# Altium project WeatherMonitor.PrjPcb
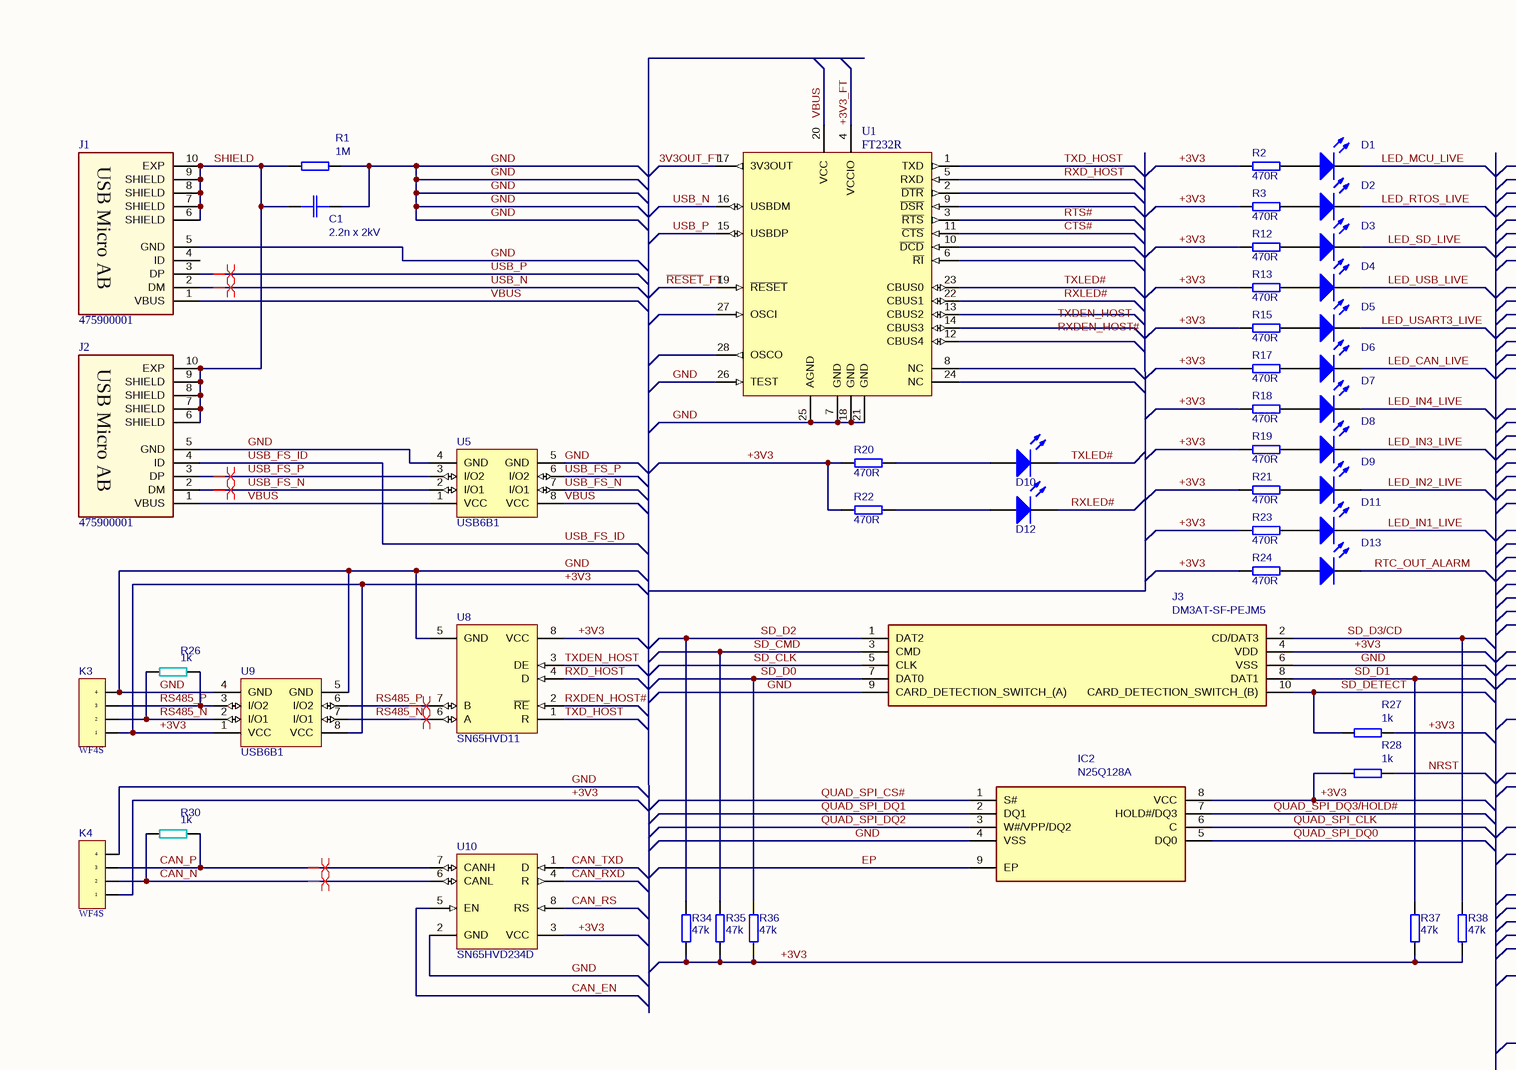
[diagram p0: WeatherMonitor.SchDoc, top left]
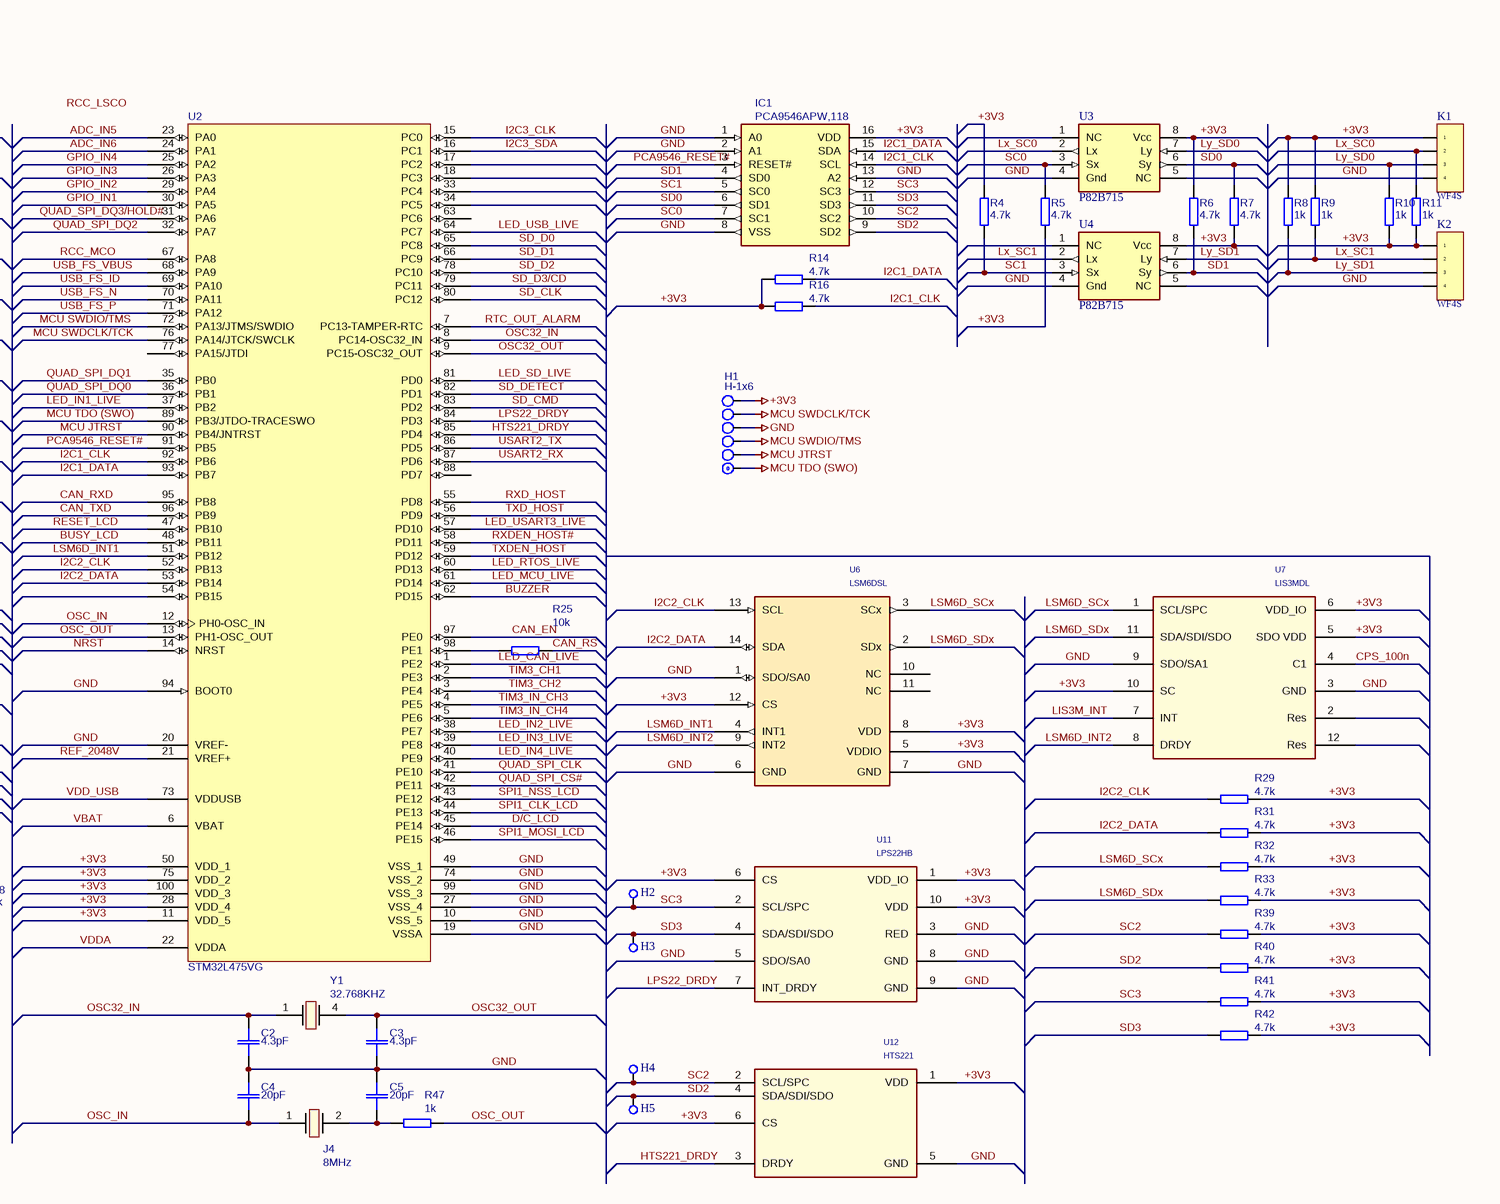
[diagram p1: WeatherMonitor.SchDoc, top right]
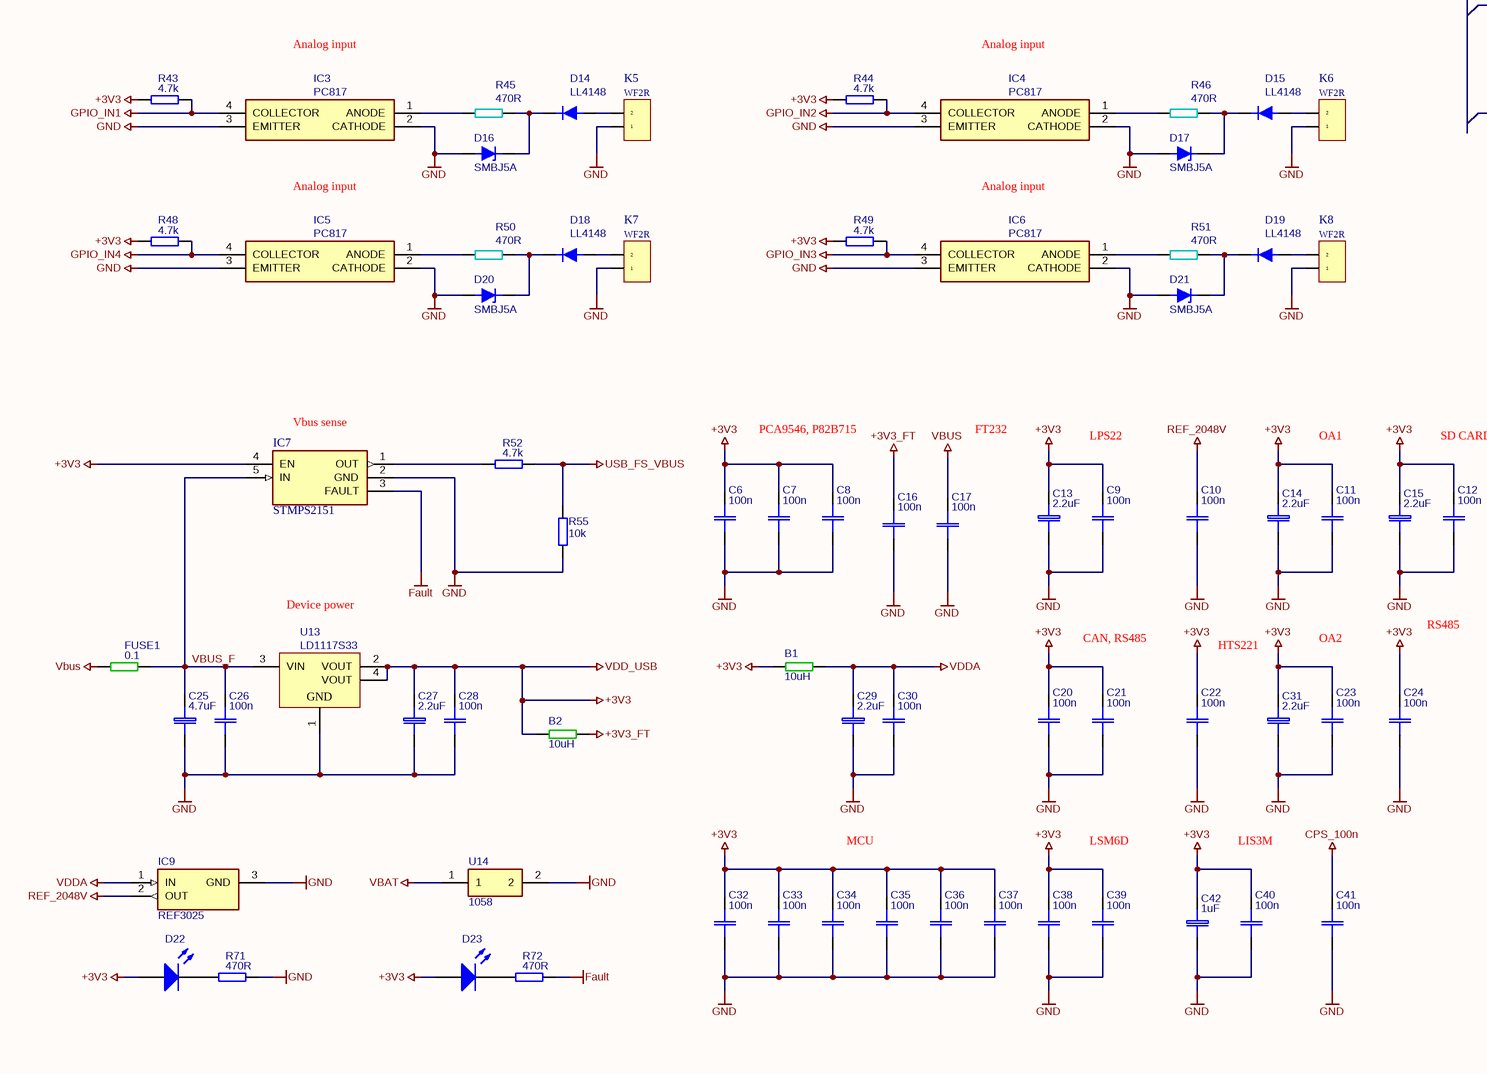
[diagram p2: WeatherMonitor.SchDoc, bottom left]
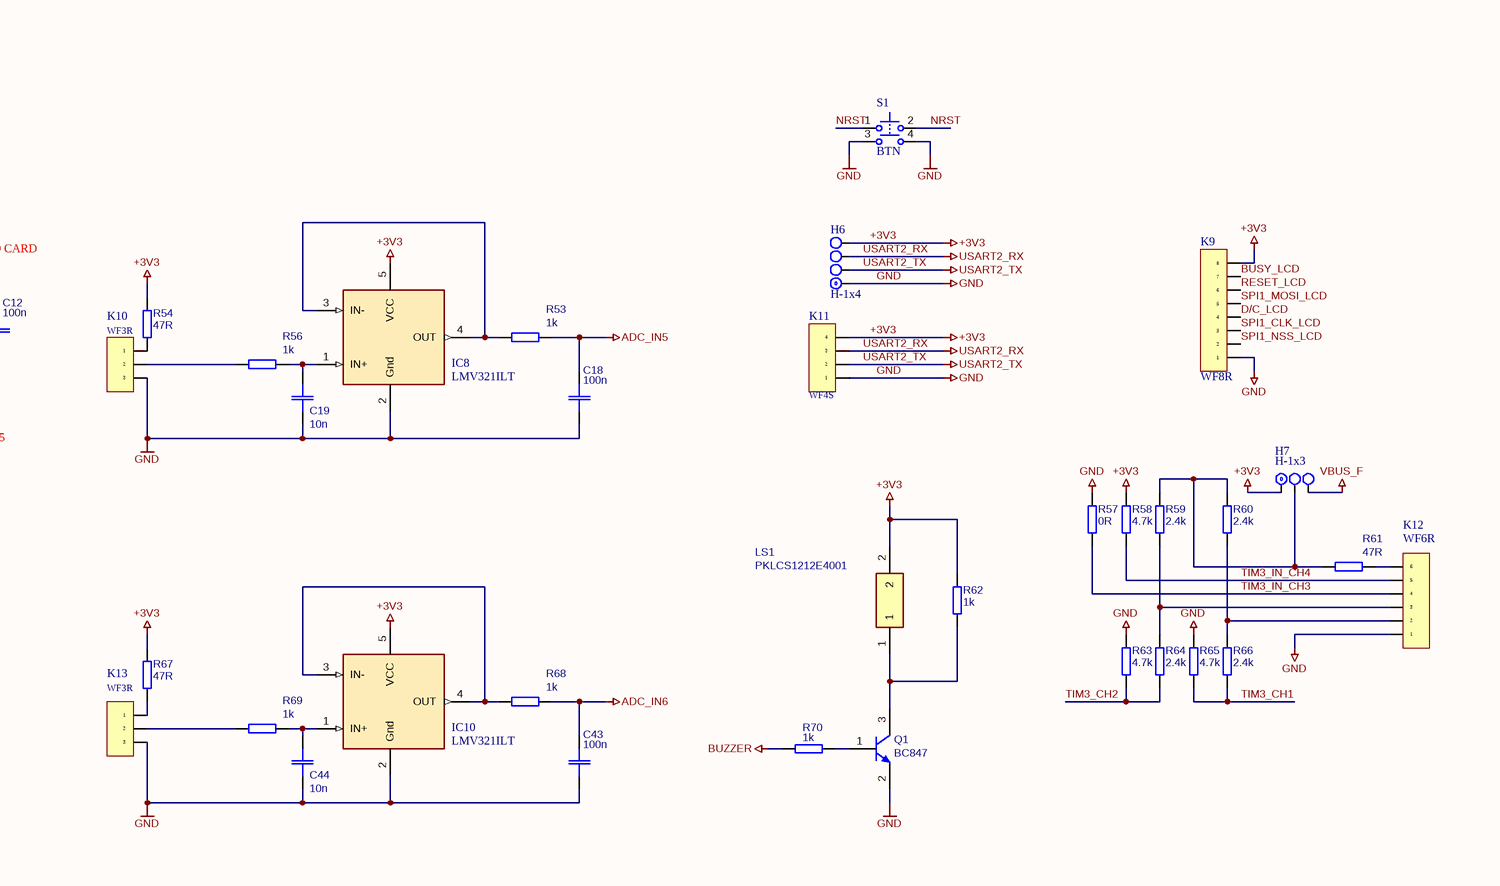
[diagram p3: WeatherMonitor.SchDoc, bottom right]
1 sheet, 194 parts. Net scope: global (net labels, ports and power ports of the same name join across sheets).
Board file: WeatherMonitor.PcbDoc

## Sheet WeatherMonitor.SchDoc
size A2

### Parts
B1  10uH  [R1210]
B2  10uH  [R1210]
C1  value 2.2n x 2kV  [C Y2 D13 7.5a]  (hidden comment: 2.2nF)
C2  4.3pF  [C0603]
C3  4.3pF  [C0603]
C4  20pF  [C0603]
C5  20pF  [C0603]
C6  100n  [C0805(2013)]
C7  100n  [C0805(2013)]
C8  100n  [C0805(2013)]
C9  100n  [C0805(2013)]
C10  value 100n  [C0805(2013)]  (hidden comment: 10n)
C11  100n  [C0805(2013)]
C12  100n  [C0805(2013)]
C13  2.2uF  [EL Case B (3528-21)]
C14  2.2uF  [EL Case B (3528-21)]
C15  2.2uF  [EL Case B (3528-21)]
C16  100n  [C0805(2013)]
C17  100n  [C0805(2013)]
C18  100n  [C0805(2013)]
C19  value 10n  [C0805(2013)]  (hidden comment: 100n)
C20  100n  [C0805(2013)]
C21  100n  [C0805(2013)]
C22  100n  [C0805(2013)]
C23  100n  [C0805(2013)]
C24  100n  [C0805(2013)]
C25  4.7uF  [EL Case B (3528-21)]
C26  100n  [C0805(2013)]
C27  2.2uF  [EL Case B (3528-21)]
C28  100n  [C0805(2013)]
C29  2.2uF  [EL Case B (3528-21)]
C30  100n  [C0805(2013)]
C31  2.2uF  [EL Case B (3528-21)]
C32  100n  [C0805(2013)]
C33  100n  [C0805(2013)]
C34  100n  [C0805(2013)]
C35  100n  [C0805(2013)]
C36  100n  [C0805(2013)]
C37  100n  [C0805(2013)]
C38  100n  [C0805(2013)]
C39  100n  [C0805(2013)]
C40  100n  [C0805(2013)]
C41  100n  [C0805(2013)]
C42  value 1uF  [EL Case B (3528-21)]  (hidden comment: 2.2uF)
C43  100n  [C0805(2013)]
C44  value 10n  [C0805(2013)]  (hidden comment: 100n)
D1  LED  [C0805(2013)]  (value not drawn)
D2  LED  [C0805(2013)]  (value not drawn)
D3  LED  [C0805(2013)]  (value not drawn)
D4  LED  [C0805(2013)]  (value not drawn)
D5  LED  [C0805(2013)]  (value not drawn)
D6  LED  [C0805(2013)]  (value not drawn)
D7  LED  [C0805(2013)]  (value not drawn)
D8  LED  [C0805(2013)]  (value not drawn)
D9  LED  [C0805(2013)]  (value not drawn)
D10  LED  [C0805(2013)]  (value not drawn)
D11  LED  [C0805(2013)]  (value not drawn)
D12  LED  [C0805(2013)]  (value not drawn)
D13  LED  [C0805(2013)]  (value not drawn)
D14  LL4148  [SOD80/MLL34]
D15  LL4148  [SOD80/MLL34]
D16  SMBJ5A  [DO-214AA (SMB)]
D17  SMBJ5A  [DO-214AA (SMB)]
D18  LL4148  [SOD80/MLL34]
D19  LL4148  [SOD80/MLL34]
D20  SMBJ5A  [DO-214AA (SMB)]
D21  SMBJ5A  [DO-214AA (SMB)]
D22  LED  [C0805(2013)]  (value not drawn)
D23  LED  [C0805(2013)]  (value not drawn)
FUSE1  0.1  [R1210]
H1  H-1x6  [J1x6]
H2  H-1  [J1]  (value not drawn)
H3  H-1  [J1]  (value not drawn)
H4  H-1  [J1]  (value not drawn)
H5  H-1  [J1]  (value not drawn)
H6  H-1x4  [J1x4]
H7  H-1x3  [J1x3]
IC1  PCA9546APW,118  [SOP65P640X110-16N]
IC2  N25Q128A  [SON127P800X600X100-9N-D]
IC3  PC817  [SOP254P960X420-4N]
IC4  PC817  [SOP254P960X420-4N]
IC5  PC817  [SOP254P960X420-4N]
IC6  PC817  [SOP254P960X420-4N]
IC7  STMPS2151  [SOT95P280X145-5N]
IC8  LMV321ILT  [SOT95P280X145-5N]
IC9  REF3025  [SOT95P237X112-3N]
IC10  LMV321ILT  [SOT95P280X145-5N]
J1  475900001  [CON_USBMICROAB_MOLEX_47590-0001_H3]
J2  475900001  [CON_USBMICROAB_MOLEX_47590-0001_H3]
J3  DM3AT-SF-PEJM5  [DM3AT-SF-PEJM5_1]
J4  8MHz  [LFXTAL003166Reel]
K1  WF4S  [WF4R]
K2  WF4S  [WF4R]
K3  WF4S  [WF4R]
K4  WF4S  [WF4R]
K5  WF2R  [WF2R]
K6  WF2R  [WF2R]
K7  WF2R  [WF2R]
K8  WF2R  [WF2R]
K9  WF8R  [WF8R]
K10  WF3R  [WF3R]
K11  WF4S  [WF4R]
K12  WF6R  [WF6R]
K13  WF3R  [WF3R]
LS1  PKLCS1212E4001  [PKLCS1212E4001]
Q1  BC847  [ONSC-SOT-23-3-318-08_V]
R1  1M  [R1206]
R2  470R  [R0805]
R3  470R  [R0805]
R4  4.7k  [R0805]
R5  4.7k  [R0805]
R6  4.7k  [R0805]
R7  4.7k  [R0805]
R8  1k  [R0805]
R9  1k  [R0805]
R10  1k  [R0805]
R11  1k  [R0805]
R12  470R  [R0805]
R13  470R  [R0805]
R14  4.7k  [R0805]
R15  470R  [R0805]
R16  4.7k  [R0805]
R17  470R  [R0805]
R18  470R  [R0805]
R19  470R  [R0805]
R20  470R  [R0805]
R21  470R  [R0805]
R22  470R  [R0805]
R23  470R  [R0805]
R24  470R  [R0805]
R25  10k  [R0805]
R26  value 1k  [R1206]  (hidden comment: 120R)
R27  1k  [R0805]
R28  value 1k  [R0805]  (hidden comment: 4.7k)
R29  4.7k  [R0805]
R30  value 1k  [R1206]  (hidden comment: 120R)
R31  4.7k  [R0805]
R32  4.7k  [R0805]
R33  4.7k  [R0805]
R34  47k  [R0805]
R35  47k  [R0805]
R36  47k  [R0805]
R37  47k  [R0805]
R38  47k  [R0805]
R39  4.7k  [R0805]
R40  4.7k  [R0805]
R41  4.7k  [R0805]
R42  4.7k  [R0805]
R43  4.7k  [R0805]
R44  4.7k  [R0805]
R45  470R  [R1206]
R46  470R  [R1206]
R47  value 1k  [R0805]  (hidden comment: 0R)
R48  4.7k  [R0805]
R49  4.7k  [R0805]
R50  470R  [R1206]
R51  470R  [R1206]
R52  4.7k  [R0805]
R53  1k  [R0805]
R54  47R  [R0805]
R55  10k  [R0805]
R56  1k  [R0805]
R57  0R  [R0805]
R58  4.7k  [R0805]
R59  2.4k  [R0805]
R60  2.4k  [R0805]
R61  47R  [R0805]
R62  1k  [R0805]
R63  4.7k  [R0805]
R64  2.4k  [R0805]
R65  4.7k  [R0805]
R66  2.4k  [R0805]
R67  47R  [R0805]
R68  1k  [R0805]
R69  1k  [R0805]
R70  1k  [R0805]
R71  470R  [R0805]
R72  470R  [R0805]
S1  BTN  [IT-2175]
U1  FT232R  [SSOP-28_N]
U2  STM32L475VG  [LQFP100_L]
U3  P82B715  [SOIC-8]
U4  P82B715  [SOIC-8]
U5  USB6B1  [SOIC-8]
U6  LSM6DSL  [LGA14L-2.5X3X0.86p0.5]
U7  LIS3MDL  [LGA12 2x2x1mm]
U8  SN65HVD11  [SOIC-8]
U9  USB6B1  [SOIC-8]
U10  SN65HVD234D  [SOIC-8]
U11  LPS22HB  [HLGA10L-2X2X0.76]
U12  HTS221  [HLGA6L-2x2x0.9]
U13  LD1117S33  [SOT-223_N]
U14  1058  [1058]
Y1  32.768KHZ  [ABS25]

### Nets
+3V3: B1.1 B2.1 C6.1 C7.1 C8.1 C9.1 C11.1 C12.1 C13.1(+) C14.1(+) C15.1(+) C20.1 C21.1 C22.1 C23.1 C24.1 C27.1(+) C28.1 C31.1(+) C32.1 C33.1 C34.1 C35.1 C36.1 C37.1 C38.1 C39.1 C40.1 C42.1(+) D22.1(A) D23.1(A) H1.6 H6.4 H7.1 IC1.16(VDD) IC2.8(VCC) IC7.4(EN) IC8.5(VCC) IC10.5(VCC) J3.4(VDD) K1.1 K2.1 K3.1 K4.1 K9.8 K11.4 LS1.2 R2.1 R3.1 R4.1 R5.2 R6.1 R7.2 R8.1 R9.1 R10.2 R11.2 R12.1 R13.1 R14.1 R15.1 R16.1 R17.1 R18.1 R19.1 R20.2 R21.1 R22.2 R23.1 R24.1 R27.1 R28.2 R29.2 R31.2 R32.2 R33.2 R34.2 R35.2 R36.2 R37.2 R38.2 R39.2 R40.2 R41.2 R42.2 R43.2 R44.2 R48.2 R49.2 R54.1 R58.1 R62.2 R67.1 U2.11(VDD_5) U2.28(VDD_4) U2.50(VDD_1) U2.73(VDDUSB) U2.75(VDD_2) U2.100(VDD_3) U3.8(Vcc) U4.8(Vcc) U6.5(VDDIO) U6.8(VDD) U6.12(CS) U7.5(SDO_VDD) U7.6(VDD_IO) U7.10(SC) U8.8(VCC) U9.1(VCC) U9.8(VCC) U10.3(VCC) U11.1(VDD_IO) U11.6(CS) U11.10(VDD) U12.1(VDD) U12.6(CS) U13.2(VOUT) U13.4(VOUT)  [also labelled VDD_USB]
+3V3_FT: B2.2 C16.1 U1.4(VCCIO)
ADC_IN5: C18.1 R53.1 U2.23(PA0)
ADC_IN6: C43.1 R68.1 U2.24(PA1)
BUZZER: R70.1 U2.62(PD15)
CPS_100n: C41.1 U7.4(C1)
Fault: IC7.3(FAULT) R72.1
GND: C1.2 C2.1 C3.1 C4.2 C5.2 C6.2 C7.2 C8.2 C9.2 C10.2 C11.2 C12.2 C13.2(-) C14.2(-) C15.2(-) C16.2 C17.2 C18.2 C19.2 C20.2 C21.2 C22.2 C23.2 C24.2 C25.2(-) C26.2 C27.2(-) C28.2 C29.2(-) C30.2 C31.2(-) C32.2 C33.2 C34.2 C35.2 C36.2 C37.2 C38.2 C39.2 C40.2 C41.2 C42.2(-) C43.2 C44.2 D16.1(A) D17.1(A) D20.1(A) D21.1(A) H1.4 H6.1 IC1.1(A0) IC1.2(A1) IC1.8(VSS) IC1.13(A2) IC2.4(VSS) IC3.2(CATHODE) IC3.3(EMITTER) IC4.2(CATHODE) IC4.3(EMITTER) IC5.2(CATHODE) IC5.3(EMITTER) IC6.2(CATHODE) IC6.3(EMITTER) IC7.2(GND) IC8.2(Gnd) IC9.3(GND) IC10.2(Gnd) J1.5(GND) J2.5(GND) J3.6(VSS) J3.9(CARD_DETECTION_SWITCH_(A)) K1.4 K2.4 K3.4 K4.4 K5.1 K6.1 K7.1 K8.1 K9.1 K10.3 K11.1 K12.1 K13.3 Q1.2(E) R1.1 R55.2 R57.1 R63.1 R65.1 R71.1 S1.3 S1.4 U1.7(GND) U1.18(GND) U1.21(GND) U1.25(AGND) U1.26(TEST) U2.10(VSS_5) U2.19(VSSA) U2.20(VREF-) U2.27(VSS_4) U2.49(VSS_1) U2.74(VSS_2) U2.94(BOOT0) U2.99(VSS_3) U3.4(Gnd) U4.4(Gnd) U5.4(GND) U5.5(GND) U6.1(SDO/SA0) U6.6(GND) U6.7(GND) U7.3(GND) U7.9(SDO/SA1) U8.5(GND) U9.4(GND) U9.5(GND) U10.2(GND) U11.3(RED) U11.5(SDO/SA0) U11.8(GND) U11.9(GND) U12.5(GND) U13.1(GND) U14.2
GPIO_IN1: IC3.4(COLLECTOR) R43.1 U2.30(PA5)
GPIO_IN2: IC4.4(COLLECTOR) R44.1 U2.29(PA4)
GPIO_IN3: IC6.4(COLLECTOR) R49.1 U2.26(PA3)
GPIO_IN4: IC5.4(COLLECTOR) R48.1 U2.25(PA2)
MCU JTRST: H1.2 U2.90(PB4/JNTRST)
MCU SWDCLK/TCK: H1.5 U2.76(PA14/JTCK/SWCLK)
MCU SWDIO/TMS: H1.3 U2.72(PA13/JTMS/SWDIO)
MCU TDO (SWO): H1.1 U2.89(PB3/JTDO-TRACESWO)
REF_2048V: C10.1 IC9.2(OUT) U2.21(VREF+)
USART2_RX: H6.3 K11.3 U2.87(PD6)
USART2_TX: H6.2 K11.2 U2.86(PD5)
USB_FS_VBUS: R52.1 R55.1 U2.68(PA9)
VBAT: U2.6(VBAT) U14.1
VBUS: C17.1 FUSE1.2 J1.1(VBUS) J2.1(VBUS) U1.20(VCC) U5.1(VCC) U5.8(VCC)
VBUS_F: C25.1(+) C26.1 FUSE1.1 H7.3 IC7.5(IN) U13.3(VIN)
VDDA: B1.2 C29.1(+) C30.1 IC9.1(IN) U2.22(VDDA)
3V3OUT_FT: U1.17(3V3OUT)
BUSY_LCD: K9.7 U2.48(PB11)
CAN_EN: U2.97(PE0) U10.5(EN)
CAN_N: K4.2 R30.2 U10.6(CANL)
CAN_P: K4.3 R30.1 U10.7(CANH)
CAN_RS: R25.2 U10.8(RS)
CAN_RXD: U2.95(PB8) U10.4(R)
CAN_TXD: U2.96(PB9) U10.1(D)
CTS#: U1.11(~{CTS})
D/C_LCD: K9.4 U2.45(PE14)
EP: IC2.9(EP)
HTS221_DRDY: U2.85(PD4) U12.3(DRDY)
I2C1_CLK: IC1.14(SCL) R16.2 U2.92(PB6)
I2C1_DATA: IC1.15(SDA) R14.2 U2.93(PB7)
I2C2_CLK: R29.1 U2.52(PB13) U6.13(SCL)
I2C2_DATA: R31.1 U2.53(PB14) U6.14(SDA)
I2C3_CLK: U2.15(PC0)
I2C3_SDA: U2.16(PC1)
LED_CAN_LIVE: D6.2(K) U2.1(PE2)
LED_IN1_LIVE: D11.2(K) U2.37(PB2)
LED_IN2_LIVE: D9.2(K) U2.38(PE7)
LED_IN3_LIVE: D8.2(K) U2.39(PE8)
LED_IN4_LIVE: D7.2(K) U2.40(PE9)
LED_MCU_LIVE: D1.2(K) U2.61(PD14)
LED_RTOS_LIVE: D2.2(K) U2.60(PD13)
LED_SD_LIVE: D3.2(K) U2.81(PD0)
LED_USART3_LIVE: D5.2(K) U2.57(PD10)
LED_USB_LIVE: D4.2(K) U2.64(PC7)
LIS3M_INT: U7.7(INT)
LPS22_DRDY: U2.84(PD3) U11.7(INT_DRDY)
LSM6D_INT1: U2.51(PB12) U6.4(INT1)
LSM6D_INT2: U6.9(INT2) U7.8(DRDY)
LSM6D_SCx: R32.1 U6.3(SCx) U7.1(SCL/SPC)
LSM6D_SDx: R33.1 U6.2(SDx) U7.11(SDA/SDI/SDO)
Lx_SC0: K1.2 R11.1 U3.2(Lx)
Lx_SC1: K2.2 R9.2 U4.2(Lx)
Ly_SD0: K1.3 R10.1 U3.7(Ly)
Ly_SD1: K2.3 R8.2 U4.7(Ly)
NRST: R28.1 S1.1 S1.2 U2.14(NRST)
OSC32_IN: C2.2 U2.8(PC14-OSC32_IN) Y1.1
OSC32_OUT: C3.2 U2.9(PC15-OSC32_OUT) Y1.4
OSC_IN: C4.1 J4.1 U2.12(PH0-OSC_IN)
OSC_OUT: R47.1 U2.13(PH1-OSC_OUT)
PCA9546_RESET#: IC1.3(RESET#) U2.91(PB5)
QUAD_SPI_CLK: IC2.6(C) U2.41(PE10)
QUAD_SPI_CS#: IC2.1(S#) U2.42(PE11)
QUAD_SPI_DQ0: IC2.5(DQ0) U2.36(PB1)
QUAD_SPI_DQ1: IC2.2(DQ1) U2.35(PB0)
QUAD_SPI_DQ2: IC2.3(W#/VPP/DQ2) U2.32(PA7)
QUAD_SPI_DQ3/HOLD#: IC2.7(HOLD#/DQ3) U2.31(PA6)
~{RESET}_FT: U1.19(~{RESET})
RCC_MCO: U2.67(PA8)
RESET_LCD: K9.6 U2.47(PB10)
RS485_N: K3.2 R26.2 U8.6(A) U9.2(I/O1) U9.7(I/O1)
RS485_P: K3.3 R26.1 U8.7(B) U9.3(I/O2) U9.6(I/O2)
RTC_OUT_ALARM: D13.2(K) U2.7(PC13-TAMPER-RTC)
RTS#: U1.3(~{RTS})
RXD_HOST: U1.5(RXD) U2.55(PD8) U8.4(D)
RXDEN_HOST#: U2.58(PD11) U8.2(~{RE})
RXLED#: D12.2(K) U1.22(CBUS1)
SC0: IC1.7(SC1) R5.1 U3.3(Sx)
SC1: IC1.5(SC0) R4.2 U4.3(Sx)
SC2: H4.1 IC1.10(SC2) R39.1 U12.2(SCL/SPC)
SC3: H2.1 IC1.12(SC3) R41.1 U11.2(SCL/SPC)
SD0: IC1.6(SD1) R7.1 U3.6(Sy)
SD1: IC1.4(SD0) R6.2 U4.6(Sy)
SD2: H5.1 IC1.9(SD2) R40.1 U12.4(SDA/SDI/SDO)
SD3: H3.1 IC1.11(SD3) R42.1 U11.4(SDA/SDI/SDO)
SD_CLK: J3.5(CLK) U2.80(PC12)
SD_CMD: J3.3(CMD) R35.1 U2.83(PD2)
SD_D0: J3.7(DAT0) R36.1 U2.65(PC8)
SD_D1: J3.8(DAT1) R37.1 U2.66(PC9)
SD_D2: J3.1(DAT2) R34.1 U2.78(PC10)
SD_D3/CD: J3.2(CD/DAT3) R38.1 U2.79(PC11)
SD_DETECT: J3.10(CARD_DETECTION_SWITCH_(B)) R27.2 U2.82(PD1)
SHIELD: C1.1 J1.6(SHIELD) J1.7(SHIELD) J1.8(SHIELD) J1.9(SHIELD) J1.10(EXP) J2.6(SHIELD) J2.7(SHIELD) J2.8(SHIELD) J2.9(SHIELD) J2.10(EXP) R1.2
SPI1_CLK_LCD: K9.3 U2.44(PE13)
SPI1_MOSI_LCD: K9.5 U2.46(PE15)
SPI1_NSS_LCD: K9.2 U2.43(PE12)
TIM3_CH1: R65.2 R66.2 U2.2(PE3)
TIM3_CH2: R63.2 R64.2 U2.3(PE4)
TIM3_IN_CH3: K12.4 R57.2 U2.4(PE5)
TIM3_IN_CH4: K12.5 R58.2 U2.5(PE6)
TXD_HOST: U1.1(TXD) U2.56(PD9) U8.1(R)
TXDEN_HOST: U2.59(PD12) U8.3(DE)
TXLED#: D10.2(K) U1.23(CBUS0)
USB_FS_ID: J2.4(ID) U2.69(PA10)
USB_FS_N: J2.2(DM) U2.70(PA11) U5.2(I/O1) U5.7(I/O1)
USB_FS_P: J2.3(DP) U2.71(PA12) U5.3(I/O2) U5.6(I/O2)
USB_N: J1.2(DM) U1.16(USBDM)
USB_P: J1.3(DP) U1.15(USBDP)
NetC5_1: C5.1 J4.2 R47.2
NetC19_1: C19.1 IC8.1(IN+) R56.1
NetC44_1: C44.1 IC10.1(IN+) R69.1
NetD1_1: D1.1(A) R2.2
NetD2_1: D2.1(A) R3.2
NetD3_1: D3.1(A) R12.2
NetD4_1: D4.1(A) R13.2
NetD5_1: D5.1(A) R15.2
NetD6_1: D6.1(A) R17.2
NetD7_1: D7.1(A) R18.2
NetD8_1: D8.1(A) R19.2
NetD9_1: D9.1(A) R21.2
NetD10_1: D10.1(A) R20.1
NetD11_1: D11.1(A) R23.2
NetD12_1: D12.1(A) R22.1
NetD13_1: D13.1(A) R24.2
NetD14_1: D14.1(A) K5.2
NetD14_2: D14.2(C) D16.2(C) R45.1
NetD15_1: D15.1(A) K6.2
NetD15_2: D15.2(C) D17.2(C) R46.1
NetD18_1: D18.1(A) K7.2
NetD18_2: D18.2(C) D20.2(C) R50.1
NetD19_1: D19.1(A) K8.2
NetD19_2: D19.2(C) D21.2(C) R51.1
NetD22_2: D22.2(K) R71.2
NetD23_2: D23.2(K) R72.2
NetH7_2: H7.2 R59.1 R60.1 R61.2
NetIC3_1: IC3.1(ANODE) R45.2
NetIC4_1: IC4.1(ANODE) R46.2
NetIC5_1: IC5.1(ANODE) R50.2
NetIC6_1: IC6.1(ANODE) R51.2
NetIC7_1: IC7.1(OUT) R52.2
NetIC8_3: IC8.3(IN-) IC8.4(OUT) R53.2
NetIC10_3: IC10.3(IN-) IC10.4(OUT) R68.2
NetK10_1: K10.1 R54.2
NetK10_2: K10.2 R56.2
NetK12_2: K12.2 R60.2 R66.1
NetK12_3: K12.3 R59.2 R64.1
NetK12_6: K12.6 R61.1
NetK13_1: K13.1 R67.2
NetK13_2: K13.2 R69.2
NetLS1_1: LS1.1 Q1.3(C) R62.1
NetQ1_1: Q1.1(B) R70.2
NetR25_1: R25.1 U2.98(PE1)

Not connected (* = marked no-connect by the designer): J1 4(ID); U1 2(~{DTR}) 6(~{RI}) 8(NC) 9(~{DSR}) 10(~{DCD}) 12(CBUS4) 13(CBUS2) 14(CBUS3) 24(NC) 27(OSCI) 28(OSCO); U2 17(PC2) 18(PC3) 33(PC4) 34(PC5) 54(PB15) 63(PC6) 77(PA15/JTDI) 88(PD7); U3 1(NC) 5(NC); U4 1(NC) 5(NC); U6 10(NC) 11(NC); U7 2(Res) 12(Res)

### Layout directives
differential pair: CAN_N, CAN_P, RS485_N, RS485_P, USB_FS_N, USB_FS_P, USB_N
differential pair; net class USBUART: USB_P

### Notes on the sheet
- Analog input
- (near IC7) Vbus sense
- PCA9546, P82B715
- FT232
- LPS22
- OA1
- SD CARD
- Device power
- CAN, RS485
- HTS221
- OA2
- RS485
- MCU
- LSM6D
- LIS3M
- Labels drawn without touching a wire or pin: RCC_LSCO, RXDEN_HOST#, TXDEN_HOST
- (in symbol 475900001) USB Micro AB

### Library data of the parts
B1 B2 FUSE1 = R-1210: SMD 1210 0.25W 5% 200V; Price: 0.045
  B1 B2: Value: 10uH
  FUSE1: Value: 0.1
C1 C6-C12 C16-C24 C26 C28 C30 C32-C41 C43 C44 = C-0805: SMD-0805; Price: 0.014
  C6-C9 C11 C12 C16-C18 C20-C24 C26 C28 C30 C32-C41 C43: Value: 100n
C2-C5 = C-0603: SMD-0603; Price: 0.014
  C2 C3: Value: 4.3pF
  C4 C5: Value: 20pF
C13-C15 C25 C27 C29 C31 C42 = EL Case D (7343-31): EL Tantalum Case D (7343-31); Price: 0.60
  C13-C15 C27 C29 C31: Value: 2.2uF
  C25: Value: 4.7uF
D1-D13 D22 D23 = HSMZ-C190: High Performance Chip LED, Red; LuminousIntensity: 40mcd (Minimum).; PCB_Layout: Complies with manufacturer's recommendation.; Published: 11-Dec-2002; DatasheetVersion: 11-Mar-2002; PackageVersion: Mar-2002; PackageReference: 1.6X0.8X0.8; Publisher: Altium Limited; PackageDescription: SM LED; 2 Flat Leads; LED_Colour: Red; ComponentLink1Description: Manufacturer Link; ComponentLink1URL: http://www.avagotech.com/; ComponentLink2Description: Datasheet; ComponentLink2URL: http://cp.literature.agilent.com/litweb/pdf/5988-5891EN.pdf
D14 D15 D18 D19 = LL4148: 75V 0.3A SOD80/MLL34; Price: 0.006
D16 D17 D20 D21 = SMBJ18A: TVS SMB 600W 18V; Price: 0.29
IC1 = PCA9546APW,118: Integrated Circuit; Manufacturer_Name: Nexperia; Datasheet Link: https://componentsearchengine.com/Datasheets/1/PCA9546APW,118.pdf; Mouser Part Number: 771-PCA9546APW-T; Mouser Price/Stock: https://www.mouser.com/Search/Refine.aspx?Keyword=771-PCA9546APW-T; Manufacturer_Part_Number: PCA9546APW,118
IC2 = N25Q128A13EF840E: Integrated Circuit; Manufacturer_Name: Micron; Datasheet Link: https://componentsearchengine.com/Datasheets/1/N25Q128A13EF840E.pdf; Height: 1mm; Mouser Part Number: 340-182262; Mouser Price/Stock: https://www.mouser.com/Search/Refine.aspx?Keyword=340-182262; Manufacturer_Part_Number: N25Q128A13EF840E
IC3-IC6 = PC817X1NIP1B: Integrated Circuit; Manufacturer_Name: Sharp Microelectronics; Datasheet Link: https://componentsearchengine.com/Datasheets/1/PC817X1NIP1B.pdf; Height: 4.2mm; Mouser Part Number: 852-PC817X1NIP1B; Mouser Price/Stock: https://www.mouser.com/Search/Refine.aspx?Keyword=852-PC817X1NIP1B; Manufacturer_Part_Number: PC817X1NIP1B
IC7 = STMPS2151STR: Integrated Circuit; Manufacturer_Name: STMicroelectronics; Datasheet Link: https://componentsearchengine.com/Datasheets/1/STMPS2151STR.pdf; Height: 1.45mm; Mouser Part Number: 511-STMPS2151STR; Mouser Price/Stock: https://www.mouser.com/Search/Refine.aspx?Keyword=511-STMPS2151STR; Manufacturer_Part_Number: STMPS2151STR
IC8 IC10 = LMV321ILT: Integrated Circuit; Manufacturer_Name: STMicroelectronics; Datasheet Link: https://componentsearchengine.com/Datasheets/1/LMV321ILT.pdf; Height: 1.45mm; Mouser Part Number: 511-LMV321ILT; Mouser Price/Stock: https://www.mouser.com/Search/Refine.aspx?Keyword=511-LMV321ILT; Manufacturer_Part_Number: LMV321ILT
IC9 = REF3020AIDBZT: Integrated Circuit; Manufacturer_Name: Texas Instruments; Datasheet Link: http://www.ti.com/lit/ds/symlink/ref3020.pdf; Height: 1.12mm; Mouser Part Number: 595-REF3020AIDBZT; Mouser Price/Stock: https://www.mouser.com/Search/Refine.aspx?Keyword=595-REF3020AIDBZT; Manufacturer_Part_Number: REF3020AIDBZT
J1 J2 = 475900001: USB-MICRO-AB, 47590-0001, SMT, MOLEX
J3 = DM3AT-SF-PEJM5: Connector; Manufacturer_Name: Hirose; Datasheet Link: https://componentsearchengine.com/Datasheets/1/DM3AT-SF-PEJM5.pdf; Mouser Part Number: 798-DM3AT-SF-PEJM5; Mouser Price/Stock: https://www.mouser.com/Search/Refine.aspx?Keyword=798-DM3AT-SF-PEJM5; Manufacturer_Part_Number: DM3AT-SF-PEJM5
J4 = LFXTAL003166Reel: Connector; Manufacturer_Name: IQD; Datasheet Link: https://componentsearchengine.com/Datasheets/1/LFXTAL003166Reel.pdf; Height: 4.3mm; Mouser Part Number: 449-LFXTAL003166REEL; Mouser Price/Stock: https://www.mouser.com/Search/Refine.aspx?Keyword=449-LFXTAL003166REEL; Manufacturer_Part_Number: LFXTAL003166Reel
K1-K4 K11 = WF4R: 2.54mm 3A/250V; Price: 0.11
K5-K8 = WF2R: 2.54mm 3A/250V; Price: 0.06
K9 = WF8R: 2.54mm 3A/250V; Price: 0.17
K10 K13 = WF3R: 2.54mm 3A/250V; Price: 0.11
K12 = WF6R: 2.54mm 3A/250V; Price: 0.17
LS1 = PKLCS1212E4001-R1: Loudspeaker or Buzzer; Manufacturer_Name: Murata Electronics; Datasheet Link: https://componentsearchengine.com/Datasheets/1/PKLCS1212E4001-R1.pdf; Mouser Part Number: 81-PKLCS1212E4001; Mouser Price/Stock: https://www.mouser.com/Search/Refine.aspx?Keyword=81-PKLCS1212E4001; Manufacturer_Part_Number: PKLCS1212E4001-R1
Q1 = BC847ALT1: General Purpose Transistor, NPN Silicon, 3-Pin SOT-23, Tape and Reel; Manufacturer: On Semiconductor; fT Min (MHz): 100; IC Continuous (A): 0.1; DatasheetVersion: Rev. 11; PackageVersion: Rev. AP, 11/2009; PackageReference: SOT-23-3-318-08; PackageDescription: 3-Pin Small Outline Transistor, Body 2.92 x 1.3 mm, Pitch 0.95 mm; Supplier 1: Digi-Key; Supplier Part Number 1: BC847ALT1OSCT-ND; Packing: Tape and Reel; Polarity: NPN; RoHS: FALSE; Mounting Technology: Surface Mount; PartNumber: BC847ALT1; ComponentLink1Description: Manufacturer URL; ComponentLink1URL: http://www.onsemi.com/; ComponentLink2Description: Datasheet; ComponentLink2URL: http://www.onsemi.cn/pub_link/Collateral/BC846ALT1-D.PDF; ComponentLink3Description: Package Specification; ComponentLink3URL: http://www.onsemi.cn/pub_link/Collateral/318-08.PDF
R1-R25 R27-R29 R31-R44 R47-R49 R52-R72 = R-0805: SMD 0805 0.1W 5% 150V; Price: 0.017
  R1: Value: 1M
  R2 R3 R12 R13 R15 R17-R24 R71 R72: Value: 470R
  R4-R7 R14 R16 R29 R31-R33 R39-R44 R48 R49 R52 R58 R63 R65: Value: 4.7k
  R8-R11 R27 R53 R56 R62 R68-R70: Value: 1k
  R25 R55: Value: 10k
  R34-R38: Value: 47k
  R54 R61 R67: Value: 47R
  R57: Value: 0R
  R59 R60 R64 R66: Value: 2.4k
R26 R30 R45 R46 R50 R51 = R-1206: SMD 1206 0.125W 5% 200V; Price: 0.045
  R45 R46 R50 R51: Value: 470R
S1 = IT-2175: Tactile Switch, DPST; Thru-Hole; Vertical; Rating DC 12V, 50mA (max); PackageDocument: Rev.0; Published: 6-Jun-2005; DatasheetDocument: Rev.0; PackageReference: IT-2175; Publisher: Altium Limited; ComponentLink1Description: Manufacturer Link; ComponentLink1URL: http://www.ilswitch.com/; ComponentLink2Description: Device Overview; ComponentLink2URL: http://www.ilswitch.com/list.php?ac_id=010112&ai_id=91
U1 = FT232RL-Reel: USB UART Asynchronous Serial Data Transfer Chip, 28-pin SSOP, Tape and Reel; Manufacturer: FTDI; DatasheetVersion: ver 2.10, Mar-2012; PackageVersion: Mar-12; PackageReference: SSOP-28; PackageDescription: 28-Pin Small Outline Package 0.65 mm Pitch; PartNumber: FT232RL-Reel; ComponentLink1Description: Manufacturer URL; ComponentLink1URL: http://www.ftdichip.com/; ComponentLink2Description: Datasheet; ComponentLink2URL: http://www.ftdichip.com/Support/Documents/DataSheets/ICs/DS_FT232R.pdf
U2 = STM32L475VG: STM32 ARM-based 32-bit MCU with 1 Mbyte Flash, 100-pin LQFP; Published: 01-JUILLET-2018; DatasheetVersion: Juillet 2018Mar-2008; PackageVersion: JUI-2018; PackageReference: LQFP100; Publisher: Altium Limited; PackageDescription: 100-Pin Low-Profile Quad Flat Pack, 14 x 14 mm Body, 0.5 mm Pitch (LQFP100); ComponentLink1Description: Manufacturer Link; ComponentLink1URL: www.st.com/stm32; ComponentLink2Description: Datasheet; ComponentLink2URL: https://www.st.com/resource/en/datasheet/stm32l475vg.pdf
U3 U4 = P82B715: Manufacturer: Texas Instruments; PartNumber: SN65HVD11SHKJ; Eco-Plan: Green (RoHS & no Sb/Br); SubFamily: RS-485; # of TX/RX: 1 TX / 1 RX; Drivers Per Package: 1; Isolated: No; Number of Nodes: 256; Duplex: Half; Signaling Rate(Mbps): 10; Common Mode Range: -7 to 12; ESD(kV): 16; Fault Protection(V): -9 to 14; Fail Safe: Open, Short; ICC(Max)(mA): 18; Supply Voltage(s)(V): 3.3; Rating: High Temp; DatasheetVersion: SLLS934D; PackageVersion: revA, Oct-2008; PackageReference: HKJ8; PackageDescription: 8-Lead Ceramic Dual Flatpack, Body 7.3 x 5.9 mm (LxW max), Pitch 1.27 mm; Receivers Per Package: 1; Footprint: SN75176; Mounting Technology: Surface Mount; ComponentLink1Description: Datasheet; ComponentLink2Description: Package Specification
U5 U9 = USB6B1: Data Lines Protection, 2-Input Line Filter + ESD + Vbus, SO-8; Published: 6-Jun-2005; LatestRevisionDate: 13-Apr-2006; LatestRevisionNote: IPC-7351 Footprint Added.; DatasheetVersion: 2003; PackageVersion: Dec-2002; PackageReference: SO8; Publisher: Altium Limited; PackageDescription: 8-Pin Small Outline Integrated Circuit 1.27 mm Pitch; Code_JEDEC: MS-012-AA; Code_IPC: SOIC127P600-8; ComponentLink1Description: Manufacturer Link; ComponentLink1URL: http://www.st.com/; ComponentLink2Description: Datasheet; ComponentLink2URL: http://www.st.com/stonline/books/pdf/docs/5605.pdf
U6 = LSM6DSL: Accelero + Gyro MEMS (6 Axis); Supplier Part Number: LSM6DSL; Value: LSM6DSL; RoHS: RoHS Compliant; Supplier Device Package: LGA14
U7 = LIS3MDL: Magnetic sensor MEMS (3 Axis); Supplier Part Number: LIS3MDL; Value: LIS3MDL; RoHS: RoHS Compliant; Supplier Device Package: LGA12
U8 = SN65HVD11SHKJ: High Temperature 3.3 V RS-485 Transceiver, 10 Mbps, Half Duplex, -55 to 210 degC, 8-pin CFP (HIKJ); Manufacturer: Texas Instruments; Eco-Plan: Green (RoHS & no Sb/Br); # of TX/RX: 1 TX / 1 RX; Drivers Per Package: 1; Isolated: No; Number of Nodes: 256; Signaling Rate(Mbps): 10; Common Mode Range: -7 to 12; ESD(kV): 16; Fault Protection(V): -9 to 14; Fail Safe: Open, Short; ICC(Max)(mA): 18; Supply Voltage(s)(V): 3.3; DatasheetVersion: SLLS934D; PackageVersion: revA, Oct-2008; PackageReference: HKJ8; PackageDescription: 8-Lead Ceramic Dual Flatpack, Body 7.3 x 5.9 mm (LxW max), Pitch 1.27 mm; Supplier 1: Digi-Key; Supplier Part Number 1: 296-28287-5-ND; Supplier 2: Newark; Supplier Part Number 2: 09R5436; Supplier 3: Mouser; Supplier Part Number 3: 595-SN65HVD11SHKJ; SubFamily: RS-485; Receivers Per Package: 1; Duplex: Half; Rating: High Temp; Footprint: SN75176; Mounting Technology: Surface Mount; PartNumber: SN65HVD11SHKJ; ComponentLink1Description: Datasheet; ComponentLink1URL: http://www.ti.com/general/docs/lit/getliterature.tsp?genericPartNumber=SN65HVD11-HT&fileType=pdf; ComponentLink2Description: Package Specification; ComponentLink2URL: http://www.ti.com/litv/pdf/msoi002j
U10 = SN65HVD234D: 3.3V CAN Transceiver with Sleep Mode, 6 mA, -40 to 125 degC, 8-pin SOIC (D), Green (RoHS & no Sb/Br); Manufacturer: Texas Instruments; Drivers Per Package: 1; Bus Fault Voltage(V): +/-30; Transient Pulse Protection(V): -100 to 100; ICC(Max)(mA): 6; Supply Voltage(s)(V): 3.3; Rating: Catalog; DatasheetVersion: SLLS557F; PackageVersion: revM, Jun-2011; PackageReference: D8; PackageDescription: 8-Pin Plastic Small Outline Integrated Circuit, 4.9 x 3.9 mm, Pitch 1.27 mm Pitch; Supplier 1: Digi-Key; Supplier Part Number 1: 296-15228-5-ND; Supplier 2: Farnell; Supplier Part Number 2: 1212363; Supplier 3: Newark; Supplier Part Number 3: 73H4407; Supplier 4: Mouser; Supplier Part Number 4: 595-SN65HVD234D; Eco-Plan: Green (RoHS & no Sb/Br); SubFamily: CAN; Receivers Per Package: 1; Isolated: No; Low Power Mode: Sleep; Footprint: PCA82C250, excludes pin5; Mounting Technology: Surface Mount; PartNumber: SN65HVD234D; Code_JEDEC: MS-012AA; ComponentLink1Description: Datasheet; ComponentLink1URL: http://www.ti.com/general/docs/lit/getliterature.tsp?genericPartNumber=SN65HVD234&fileType=pdf
U11 = LPS22HB: MEMS nano pressure/temp sensor; Supplier Part Number: LPS22HB; Value: LPS22HB; RoHS: RoHS Compliant; Supplier Device Package: HLGA-10L
U12 = HTS221: Capacitive digital sensor for relative humidity and temperature; Supplier Part Number: HTS221; Value: HTS221; RoHS: RoHS Compliant; Supplier Device Package: HLGA-6L
U13 = LD1117S33TR: Fixed Low Drop Positive Voltage Regulator, 3.3V, 4-Pin SOT-223, Tape and Reel; DatasheetVersion: Nov-2011; PackageVersion: 2010; PackageReference: SOT-223; PackageDescription: 4-Pin SOT-223 Package, 6.5 x 3.5 mm Body, 2.3 mm Pitch, 7 mm Lead Span; PartNumber: LD1117S33TR; ComponentLink1Description: Manufacturer URL; ComponentLink1URL: http://www.st.com; ComponentLink2Description: Datasheet; ComponentLink2URL: http://www.st.com/internet/com/TECHNICAL_RESOURCES/TECHNICAL_LITERATURE/DATASHEET/CD00000544.pdf
U14 = 1058: Undefined or Miscellaneous; Manufacturer_Name: Keystone Electronics; Datasheet Link: https://componentsearchengine.com/Datasheets/1/1058.pdf; Height: 5.08mm; Mouser Part Number: 534-1058; Mouser Price/Stock: https://www.mouser.com/Search/Refine.aspx?Keyword=534-1058; Manufacturer_Part_Number: 1058
Y1 = ABS25-32.768KHZ-6-T: Crystal or Oscillator; Manufacturer_Name: ABRACON; Datasheet Link: https://componentsearchengine.com/Datasheets/1/ABS25-32.768KHZ-6-T.pdf; Mouser Part Number: 815-ABS25-32.768K6-T; Mouser Price/Stock: https://www.mouser.com/Search/Refine.aspx?Keyword=815-ABS25-32.768K6-T; Manufacturer_Part_Number: ABS25-32.768KHZ-6-T
H1 = H-1x6: Price: 0.06
H2-H5 = H-1: Price: 0.01
H6 = H-1x4: Price: 0.04
H7 = H-1x3: Price: 0.03